# Altium schematic sheet RTC_and_EEPROM.SchDoc
size A3; SheetNumber: 8; SheetTotal: 9
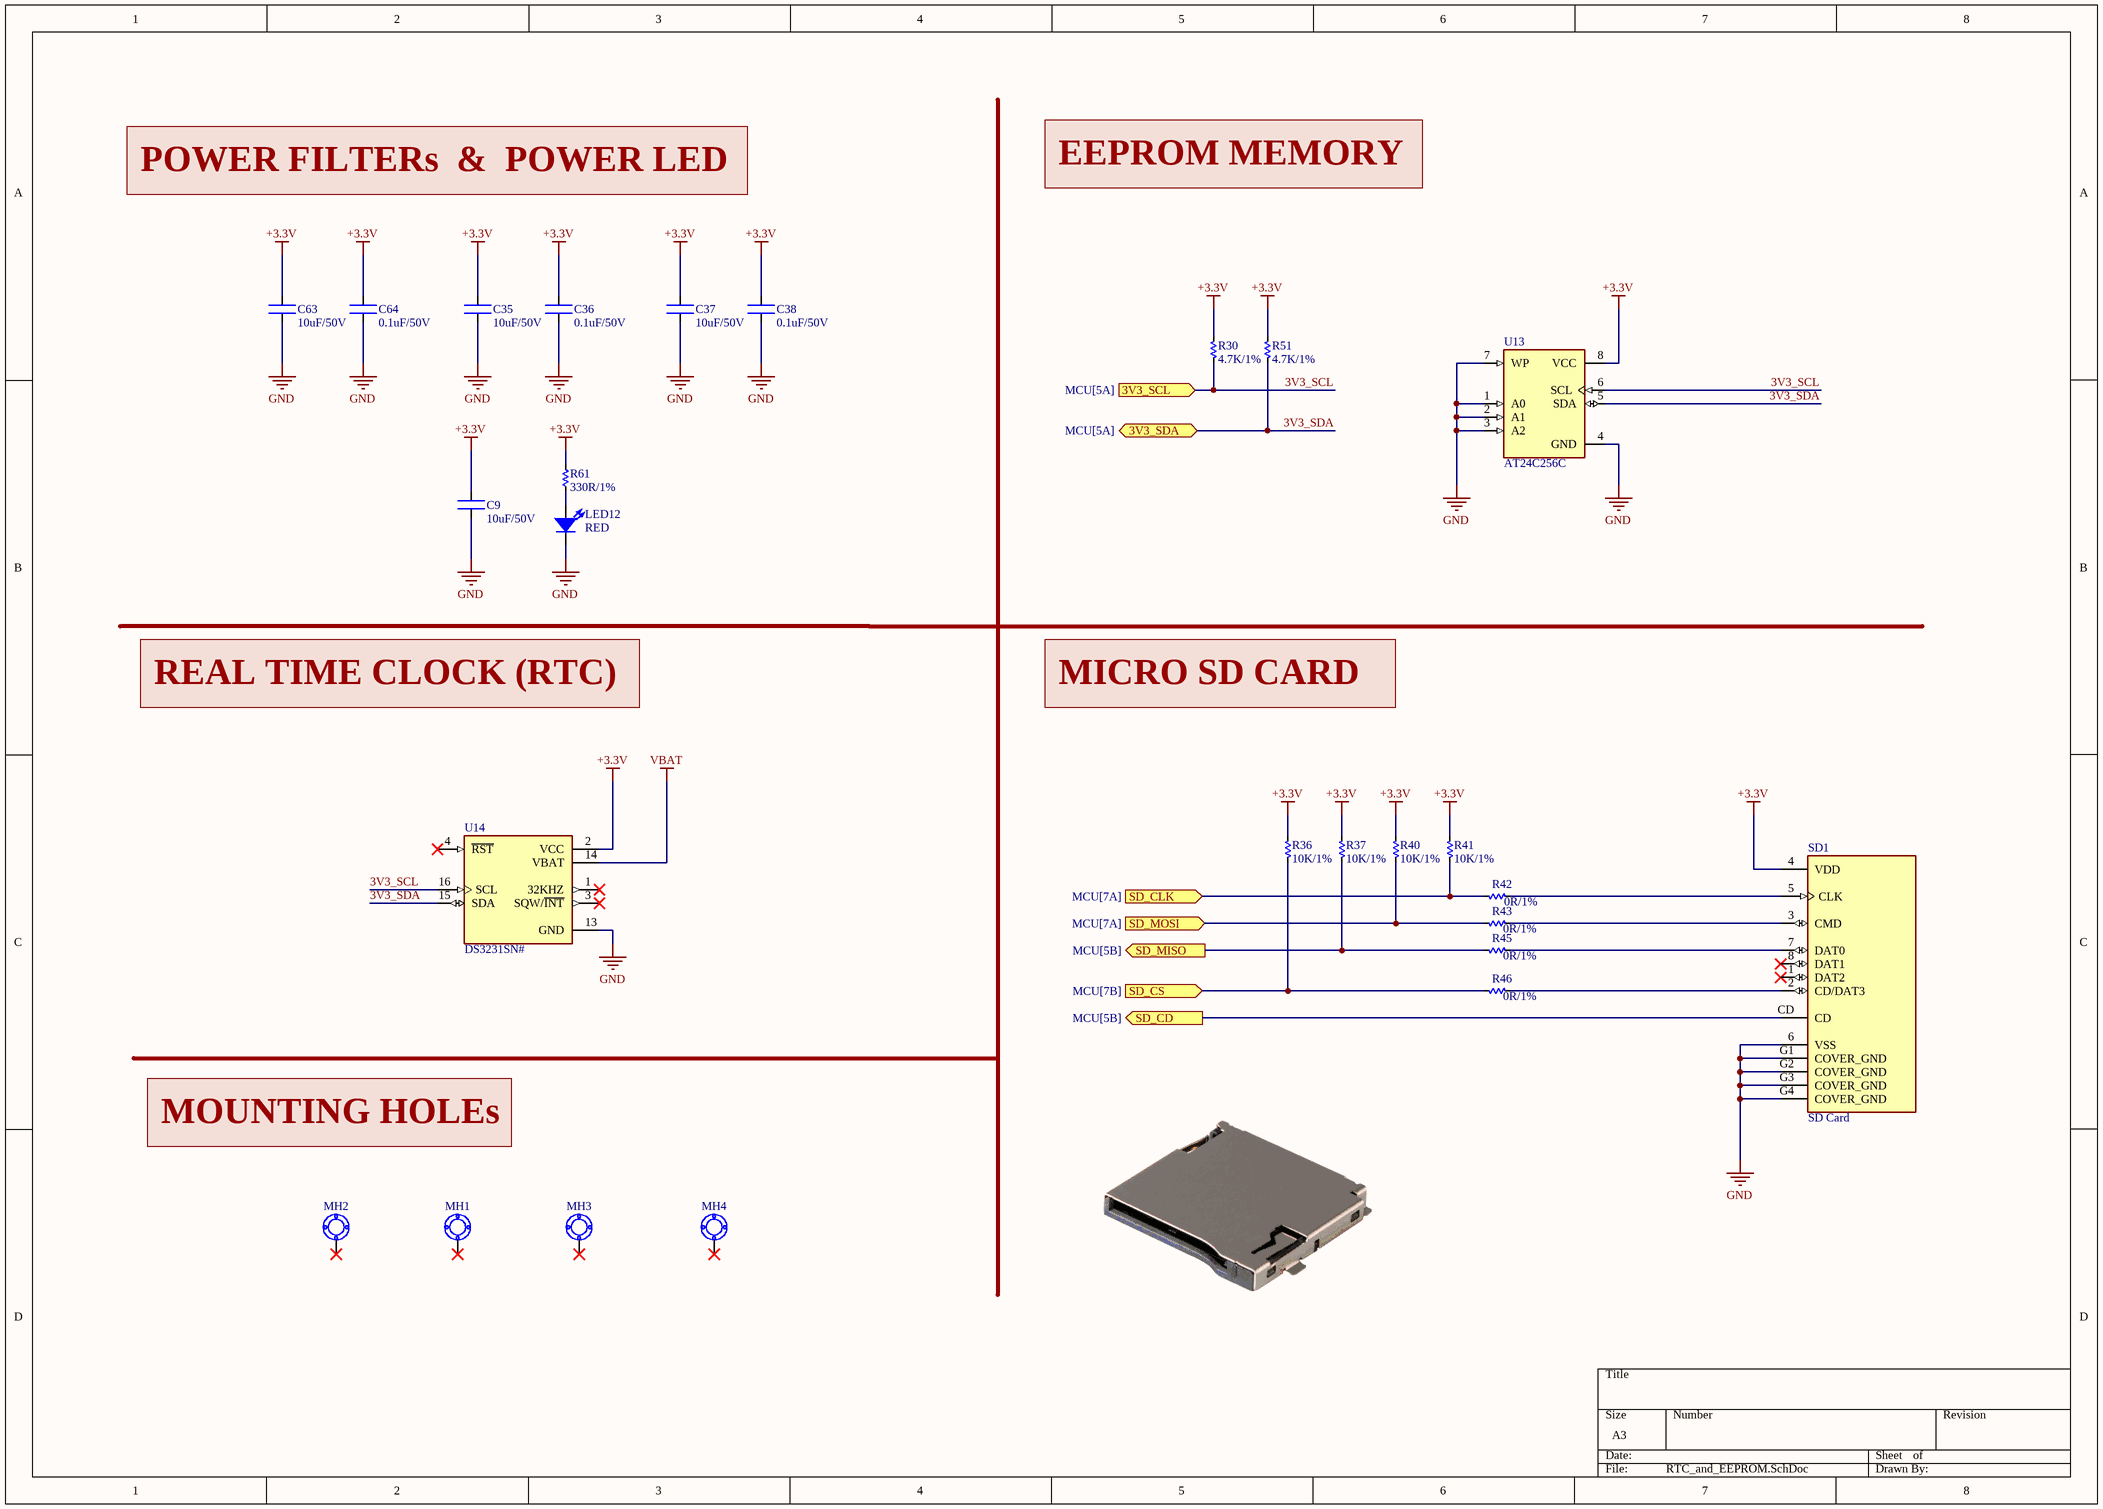
[diagram p0: RTC_and_EEPROM.SchDoc]

## Parts
C9  10uF/50V  [CAP - 0603]
C35  10uF/50V  [CAP - 0603]
C36  0.1uF/50V  [CAP - 0603]
C37  10uF/50V  [CAP - 0603]
C38  0.1uF/50V  [CAP - 0603]
C63  10uF/50V  [CAP - 0603]
C64  0.1uF/50V  [CAP - 0603]
LED12  RED  [RED_LED_0603]
MH1  MOUNTING HOLE  [Mounting hole_2]  (value not drawn)
MH2  MOUNTING HOLE  [Mounting hole_2]  (value not drawn)
MH3  MOUNTING HOLE  [Mounting hole_2]  (value not drawn)
MH4  MOUNTING HOLE  [Mounting hole_2]  (value not drawn)
R30  4.7K/1%  [RES - 0603]
R36  10K/1%  [RES - 0603]
R37  10K/1%  [RES - 0603]
R40  10K/1%  [RES - 0603]
R41  10K/1%  [RES - 0603]
R42  0R/1%  [RES - 0603]
R43  0R/1%  [RES - 0603]
R45  0R/1%  [RES - 0603]
R46  0R/1%  [RES - 0603]
R51  4.7K/1%  [RES - 0603]
R61  330R/1%  [RES - 0603]
SD1  SD Card  [MICRO SD CARD]
U13  AT24C256C  [SOIC-8]
U14  DS3231SN#  [SOIC -16]

## Ports
3V3_SCL (in, see MCU[5A]), 3V3_SDA (bidir, see MCU[5A]), SD_CD (out, see MCU[5B]), SD_CLK (in, see MCU[7A]), SD_CS (in, see MCU[7B]), SD_MISO (out, see MCU[5B]), SD_MOSI (in, see MCU[7A])

## Nets
+3.3V: C9.2 C35.2 C36.2 C37.2 C38.2 C63.2 C64.2 R30.2 R36.1 R37.1 R40.1 R41.1 R51.2 R61.1 SD1.4(VDD) U13.8(VCC) U14.2(VCC)
GND: C9.1 C35.1 C36.1 C37.1 C38.1 C63.1 C64.1 LED12.2 SD1.6(VSS) SD1.G1(COVER_GND) SD1.G2(COVER_GND) SD1.G3(COVER_GND) SD1.G4(COVER_GND) U13.1(A0) U13.2(A1) U13.3(A2) U13.4(GND) U13.7(WP) U14.13(GND)
VBAT: U14.14(VBAT)
3V3_SCL: R30.1 U13.6(SCL) U14.16(SCL) ; port 3V3_SCL
3V3_SDA: R51.1 U13.5(SDA) U14.15(SDA) ; port 3V3_SDA
SD_CD: SD1.CD ; port SD_CD
SD_CLK: R41.2 R42.2 ; port SD_CLK
SD_CS: R36.2 R46.2 ; port SD_CS
SD_MISO: R37.2 R45.2 ; port SD_MISO
SD_MOSI: R40.2 R43.2 ; port SD_MOSI
NetLED12_1: LED12.1 R61.2
NetR42_1: R42.1 SD1.5(CLK)
NetR43_1: R43.1 SD1.3(CMD)
NetR45_1: R45.1 SD1.7(DAT0)
NetR46_1: R46.1 SD1.2(CD/DAT3)

Not connected (* = marked no-connect by the designer): MH1 1(76)*; MH2 1(76)*; MH3 1(76)*; MH4 1(76)*; SD1 1(DAT2)* 8(DAT1)*; U14 1(32KHZ)* 3(SQW/~{INT})* 4(~{RST})*

## Notes on the sheet
- POWER FILTERs  &  POWER LED
- EEPROM MEMORY
- REAL TIME CLOCK (RTC)
- MICRO SD CARD
- MOUNTING HOLEs

## Library data of the parts
C9 C35-C38 C63 C64 = CAPACITOR: CAPACITOR SMD - KEMET
LED12 = LED_SMD: LED SMD
R30 R36 R37 R40-R43 R45 R46 R51 R61 = RESISTOR: Resistor SMD - YAGEO
SD1 = SD Card: Micro SD Card Connector, 9 Positions, Connector and Ejector, Push In, Auto Eject Out, Surface Mount, 0.95 mm Height Above Board, Gold Flash
U13 = AT24C256C: EEPROM Memory IC 256Kb (32K x 8), I2C Protocol
U14 = DS3231SN#: Extremely Accurate I²C-Integrated RTC/TCXO/Crystal